# Altium schematic sheet Sensors.SchDoc
size A3; PageSetup: Record=PageOptions|CenterHorizontal=True|CenterVertical=True|PrintScale=1.00|XCorrection=1.00|YCorrection=1.00|PrintKind=1|BorderSize=5000000|LeftOffset=0|BottomOffset=0|Orientation=2|PaperLength=1000|PaperWidth=1000|Scale=100|PaperSource=7|PrintQuality=-3|MediaType=1|DitherType=10|PrintScaleMode=1|PaperKind=A2|PaperIndex=66
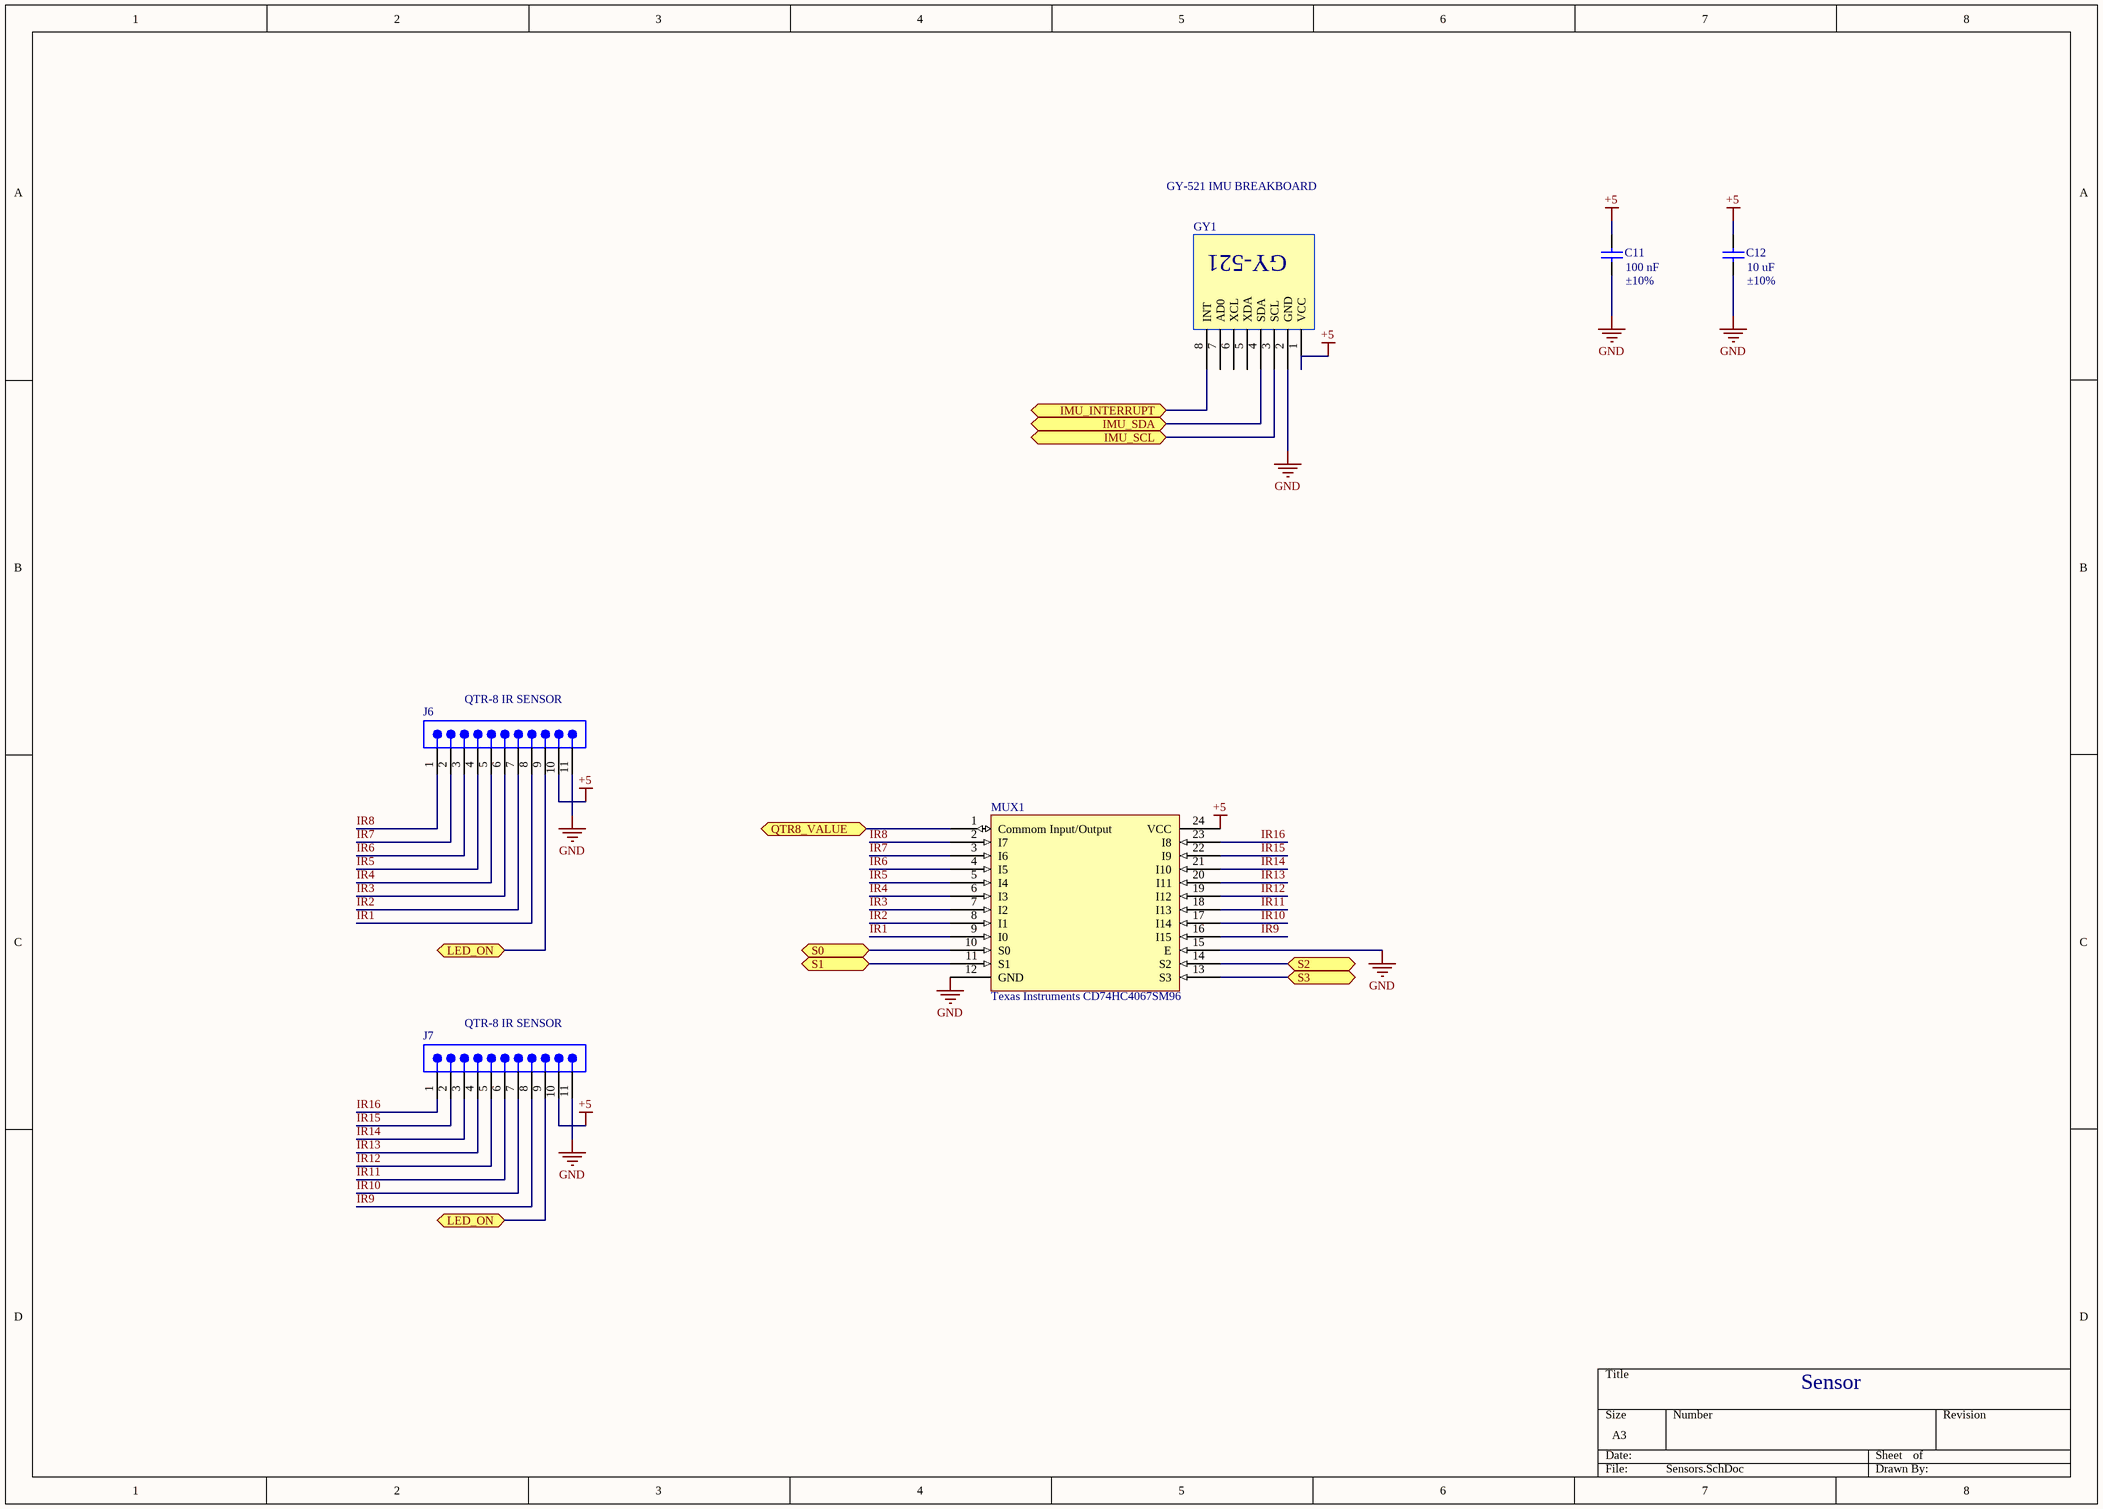
[diagram p0: Sensors.SchDoc]

## Parts
C11  Capacitance: 100 nF  Capacitance Tolerance: ±10%  [PCB-i747o4qnz4fc2aqkwc14-1]  (hidden comment: Taiyo Yuden LMK212BJ106KG-T)
C12  Capacitance: 10 uF  Capacitance Tolerance: ±10%  [PCB-i747o4qnz4fc2aqkwc14-1]  (hidden comment: Taiyo Yuden LMK212BJ106KG-T)
GY1  GY-521 MPU-6050 IMU  [PCBComponent_1]  (value not drawn)
J6  Samtec TSW-111-05-G-S  [1X11]  (value not drawn)
J7  Samtec TSW-111-05-G-S  [1X11]  (value not drawn)
MUX1  Texas Instruments CD74HC4067SM96  [PCBComponent_1]

## Ports
IMU_INTERRUPT (bidir), IMU_SCL (bidir), IMU_SDA (bidir), LED_ON (bidir), QTR8_VALUE (bidir), S0 (bidir), S1 (bidir), S2 (bidir), S3 (bidir)

## Nets
+5: C11.2 C12.2 GY1.1(VCC) J6.10 J7.10 MUX1.24(VCC)
GND: C11.1 C12.1 GY1.2(GND) J6.11 J7.11 MUX1.12(GND) MUX1.15(E)
IMU_INTERRUPT: GY1.8(INT) ; port IMU_INTERRUPT
IMU_SCL: GY1.3(SCL) ; port IMU_SCL
IMU_SDA: GY1.4(SDA) ; port IMU_SDA
IR1: J6.8 MUX1.9(I0)
IR2: J6.7 MUX1.8(I1)
IR3: J6.6 MUX1.7(I2)
IR4: J6.5 MUX1.6(I3)
IR5: J6.4 MUX1.5(I4)
IR6: J6.3 MUX1.4(I5)
IR7: J6.2 MUX1.3(I6)
IR8: J6.1 MUX1.2(I7)
IR9: J7.8 MUX1.16(I15)
IR10: J7.7 MUX1.17(I14)
IR11: J7.6 MUX1.18(I13)
IR12: J7.5 MUX1.19(I12)
IR13: J7.4 MUX1.20(I11)
IR14: J7.3 MUX1.21(I10)
IR15: J7.2 MUX1.22(I9)
IR16: J7.1 MUX1.23(I8)
LED_ON: J6.9 J7.9 ; port LED_ON
QTR8_VALUE: MUX1.1(Commom_Input/Output) ; port QTR8_VALUE
S0: MUX1.10(S0) ; port S0
S1: MUX1.11(S1) ; port S1
S2: MUX1.14(S2) ; port S2
S3: MUX1.13(S3) ; port S3

Not connected (* = marked no-connect by the designer): GY1 5(XDA) 6(XCL) 7(AD0)

## Notes on the sheet
- GY-521 IMU BREAKBOARD
- (near J6) QTR-8 IR SENSOR
- (near J7) QTR-8 IR SENSOR
- Sensor
- (in symbol CMP-1172158-5) GY-521

## Library data of the parts
C11 C12 = CMP-6ecba7c24c09b10c-2: Cap Ceramic 10uF 10V X5R 10% SMD 0805 85?C T/R; Lead-Free Status: Lead Free; Voltage Rating (DC): 10.0 V; Case/Package (SI): 2012; Mounting Style: Surface Mount; Manufacturer Part Number: LMK212BJ106KG-T; Packaging: Cut Tape (CT); RoHS: Compliant; Number of Pins: 2; Lifecycle Status: Not Listed by Manufacturer; OctopartID: 6ecba7c24c09b10c; Size-Length: 0.002 m; Size-Height: 0.00125 m; Dielectric Characteristic: X5R; Octopart URL: http://octopart.com/lmk212bj106kg-t-taiyo+yuden-198564; Size-Width: 0.00125 m; Case/Package: 0805
GY1 = CMP-1172158-5: 3-axis gyroscope, 3-axis accelerometer breakout board; Supply Voltage (DC): 5v; Packaging: Cut Tape (CT); REACH SVHC Compliance: No SVHC; Number of Pins: 8; Octopart URL: http://octopart.com/mpu-6050-invensense-19505926; OctopartID: 29a8e18bafc8f66f; RoHS: Compliant; Manufacturer Part Number: MPU-6050
J6 J7 = CMP-3970764-2: CONN HEADER 11POS .100" SGL GOLD; Gender: Male; Lead-Free Status: Lead Free; Number of Contacts: 11; Pin Pitch: 0.00254 m; Contact Material: Phosphor Bronze; Contact Plating: Gold; Housing Color: Black; Housing Material: Plastic; Mounting Style: Through Hole; Number of Positions: 11; Number of Rows: 1; Octopart Url: https://octopart.com/tsw-111-05-g-s-samtec-271406; OctopartID: 84944d9a85dc5b53; REACH SVHC Compliance: No SVHC; RoHS: Compliant; Size-Height: 0.00254 m; Size-Length: 0.02794 m; Size-Width: 0.00254 m
MUX1 = CMP-106ed96303d9cfa9-2: High Speed CMOS 16-Channel Analog Multiplexer/Demultiplexer 24-SSOP -55 to 125; Supply Voltage (DC): 2.00 V (min); Number of Bits: 16; Lead-Free Status: Lead Free; Number of Circuits: 1; Polarity: Non-Inverting; Mounting Style: Surface Mount; OctopartID: 106ed96303d9cfa9; Case/Package: SSOP; Number of Outputs: 16; Number of Channels: 16; RoHS: Compliant; Number of Pins: 24; Lifecycle Status: Active; REACH SVHC Compliance: No SVHC; Packaging: Tape & Reel (TR), Cut Tape (CT); Octopart URL: http://octopart.com/cd74hc4067sm96-texas+instruments-472785; Manufacturer Part Number: CD74HC4067SM96